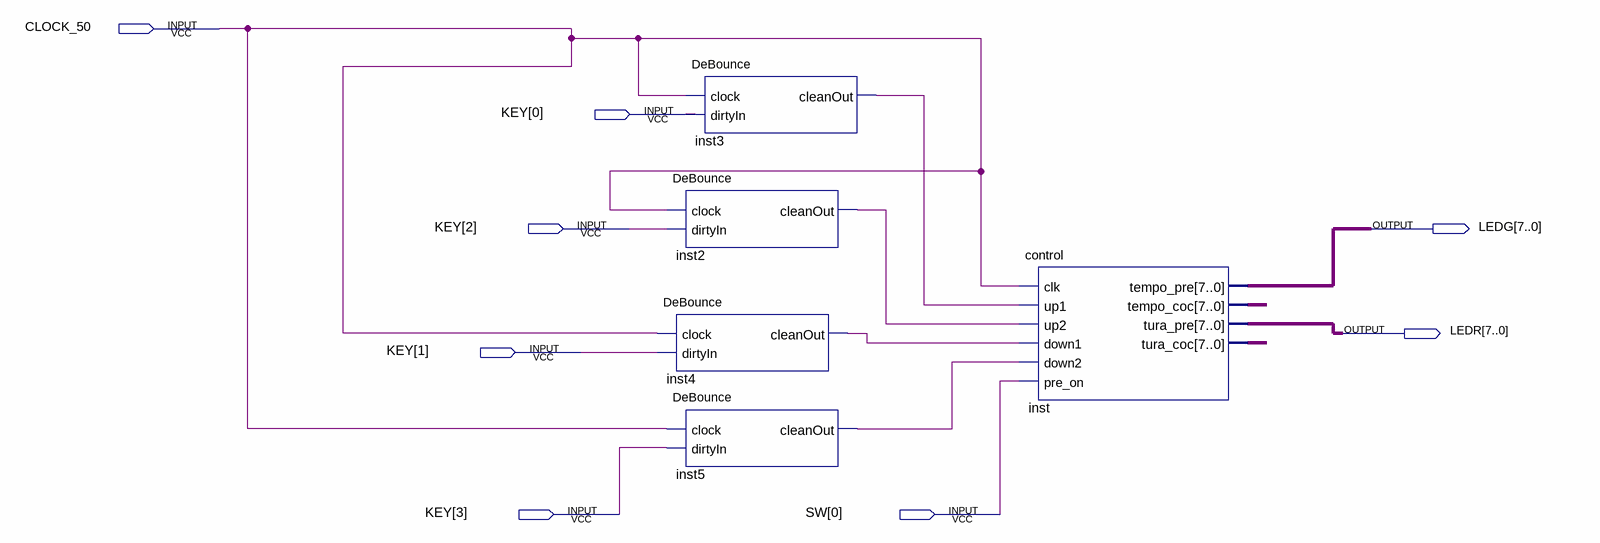
[diagram p0: schematic sheet]
// Quartus schematic contro_Demo.bdf as structural Verilog: 5 symbols, 8 pins
module contro_Demo (
  input  CLOCK_50,
  input  [3:0] KEY,
  input  [0:0] SW,
  output [7:0] LEDG,
  output [7:0] LEDR
);

  wire inst2_cleanout, inst3_cleanout, inst4_cleanout, inst5_cleanout;
  wire [7:0] inst_tempo_coc, inst_tura_coc;

  DeBounce inst3 (.clock(CLOCK_50), .dirtyIn(KEY[0]), .cleanOut(inst3_cleanout));
  DeBounce inst2 (.clock(CLOCK_50), .dirtyIn(KEY[2]), .cleanOut(inst2_cleanout));
  DeBounce inst4 (.clock(CLOCK_50), .dirtyIn(KEY[1]), .cleanOut(inst4_cleanout));
  DeBounce inst5 (.clock(CLOCK_50), .dirtyIn(KEY[3]), .cleanOut(inst5_cleanout));
  control inst (
    .clk(CLOCK_50), .up1(inst3_cleanout), .up2(inst2_cleanout), .down1(inst4_cleanout),
    .down2(inst5_cleanout), .pre_on(SW[0]), .tempo_pre(LEDG), .tempo_coc(inst_tempo_coc), .tura_pre(LEDR),
    .tura_coc(inst_tura_coc));
endmodule
